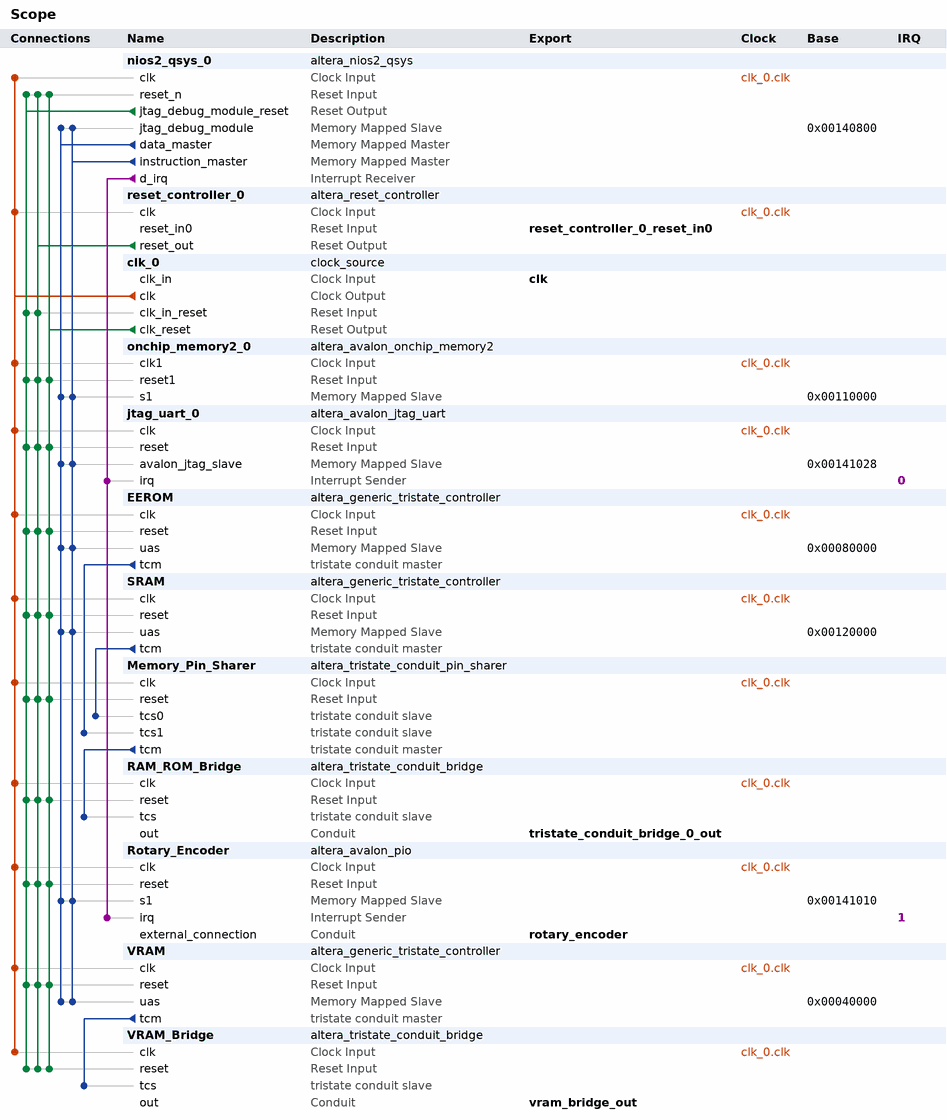
[diagram p0: system contents]
# Platform Designer (Qsys) system Scope, Cyclone III EP3C25Q240C8
# Parameters at their usual value, and those the tool derives, are not listed.
package require -exact qsys 13.1
create_system Scope
set_project_property DEVICE_FAMILY {Cyclone III}
set_project_property DEVICE EP3C25Q240C8

add_instance nios2_qsys_0 altera_nios2_qsys 13.1
set_instance_parameter_value nios2_qsys_0 resetSlave EEROM.uas
set_instance_parameter_value nios2_qsys_0 mmu_TLBMissExcSlave None
set_instance_parameter_value nios2_qsys_0 exceptionSlave EEROM.uas
set_instance_parameter_value nios2_qsys_0 breakSlave nios2_qsys_0.jtag_debug_module
set_instance_parameter_value nios2_qsys_0 impl Fast
set_instance_parameter_value nios2_qsys_0 icache_size 4096

add_instance reset_controller_0 altera_reset_controller 13.1
set_instance_parameter_value reset_controller_0 NUM_RESET_INPUTS 1
set_instance_parameter_value reset_controller_0 SYNC_DEPTH 2

add_instance clk_0 clock_source 13.1
set_instance_parameter_value clk_0 clockFrequency 30000000

add_instance onchip_memory2_0 altera_avalon_onchip_memory2 13.1
set_instance_parameter_value onchip_memory2_0 dataWidth 32
set_instance_parameter_value onchip_memory2_0 dualPort false
set_instance_parameter_value onchip_memory2_0 initMemContent true
set_instance_parameter_value onchip_memory2_0 initializationFileName onchip_mem.hex
set_instance_parameter_value onchip_memory2_0 memorySize 40960

add_instance jtag_uart_0 altera_avalon_jtag_uart 13.1
set_instance_parameter_value jtag_uart_0 simInteractiveOptions NO_INTERACTIVE_WINDOWS

add_instance EEROM altera_generic_tristate_controller 13.1
set_instance_parameter_value EEROM TCM_ADDRESS_W 19
set_instance_parameter_value EEROM TCM_DATA_W 8
set_instance_parameter_value EEROM TCM_BYTEENABLE_W 1
set_instance_parameter_value EEROM TCM_READ_WAIT 3
set_instance_parameter_value EEROM TCM_WRITE_WAIT 0
set_instance_parameter_value EEROM TCM_SETUP_WAIT 0
set_instance_parameter_value EEROM TCM_DATA_HOLD 0
set_instance_parameter_value EEROM TCM_MAX_PENDING_READ_TRANSACTIONS 1
set_instance_parameter_value EEROM TCM_TURNAROUND_TIME 2
set_instance_parameter_value EEROM TCM_TIMING_UNITS 1
set_instance_parameter_value EEROM TCM_READLATENCY 2
set_instance_parameter_value EEROM TCM_SYMBOLS_PER_WORD 1
set_instance_parameter_value EEROM USE_READ 1
set_instance_parameter_value EEROM USE_BEGINTRANSFER 0
set_instance_parameter_value EEROM USE_BYTEENABLE 0
set_instance_parameter_value EEROM USE_OUTPUTENABLE 1
set_instance_parameter_value EEROM ACTIVE_LOW_READ 0
set_instance_parameter_value EEROM ACTIVE_LOW_BYTEENABLE 0
set_instance_parameter_value EEROM ACTIVE_LOW_OUTPUTENABLE 1
set_instance_parameter_value EEROM ACTIVE_LOW_BEGINTRANSFER 0
set_instance_parameter_value EEROM CHIPSELECT_THROUGH_READLATENCY 0
set_instance_parameter_value EEROM MODULE_ASSIGNMENT_KEYS embeddedsw.configuration.hwClassnameDriverSupportList
set_instance_parameter_value EEROM MODULE_ASSIGNMENT_VALUES "altera_avalon_lan91c111\\,altera_avalon_cfi_flash"

add_instance SRAM altera_generic_tristate_controller 13.1
set_instance_parameter_value SRAM TCM_ADDRESS_W 17
set_instance_parameter_value SRAM TCM_DATA_W 8
set_instance_parameter_value SRAM TCM_BYTEENABLE_W 1
set_instance_parameter_value SRAM TCM_READ_WAIT 3
set_instance_parameter_value SRAM TCM_WRITE_WAIT 2
set_instance_parameter_value SRAM TCM_SETUP_WAIT 1
set_instance_parameter_value SRAM TCM_DATA_HOLD 1
set_instance_parameter_value SRAM TCM_MAX_PENDING_READ_TRANSACTIONS 1
set_instance_parameter_value SRAM TCM_TURNAROUND_TIME 2
set_instance_parameter_value SRAM TCM_TIMING_UNITS 1
set_instance_parameter_value SRAM TCM_READLATENCY 2
set_instance_parameter_value SRAM TCM_SYMBOLS_PER_WORD 1
set_instance_parameter_value SRAM USE_READ 1
set_instance_parameter_value SRAM USE_BEGINTRANSFER 0
set_instance_parameter_value SRAM USE_BYTEENABLE 0
set_instance_parameter_value SRAM USE_OUTPUTENABLE 1
set_instance_parameter_value SRAM ACTIVE_LOW_READ 0
set_instance_parameter_value SRAM ACTIVE_LOW_BYTEENABLE 0
set_instance_parameter_value SRAM ACTIVE_LOW_OUTPUTENABLE 1
set_instance_parameter_value SRAM ACTIVE_LOW_BEGINTRANSFER 0
set_instance_parameter_value SRAM CHIPSELECT_THROUGH_READLATENCY 0
set_instance_parameter_value SRAM MODULE_ASSIGNMENT_KEYS embeddedsw.configuration.hwClassnameDriverSupportList
set_instance_parameter_value SRAM MODULE_ASSIGNMENT_VALUES "altera_avalon_lan91c111\\,altera_avalon_cfi_flash"

add_instance Memory_Pin_Sharer altera_tristate_conduit_pin_sharer 13.1
set_instance_parameter_value Memory_Pin_Sharer NUM_INTERFACES 2
set_instance_parameter_value Memory_Pin_Sharer MODULE_ORIGIN_LIST EEROM.tcm,EEROM.tcm,EEROM.tcm,EEROM.tcm,EEROM.tcm,EEROM.tcm,SRAM.tcm,SRAM.tcm,SRAM.tcm,SRAM.tcm,SRAM.tcm,SRAM.tcm
set_instance_parameter_value Memory_Pin_Sharer SIGNAL_ORIGIN_LIST address,outputenable_n,write_n,read,data,chipselect_n,address,outputenable_n,write_n,read,data,chipselect_n
set_instance_parameter_value Memory_Pin_Sharer SHARED_SIGNAL_LIST address,,,,data,,address,,,,data

add_instance RAM_ROM_Bridge altera_tristate_conduit_bridge 13.1

add_instance Rotary_Encoder altera_avalon_pio 13.1
set_instance_parameter_value Rotary_Encoder bitClearingEdgeCapReg true
set_instance_parameter_value Rotary_Encoder captureEdge true
set_instance_parameter_value Rotary_Encoder direction Input
set_instance_parameter_value Rotary_Encoder generateIRQ true
set_instance_parameter_value Rotary_Encoder irqType EDGE
set_instance_parameter_value Rotary_Encoder width 6

add_instance VRAM altera_generic_tristate_controller 13.1
set_instance_parameter_value VRAM TCM_ADDRESS_W 18
set_instance_parameter_value VRAM TCM_DATA_W 8
set_instance_parameter_value VRAM TCM_BYTEENABLE_W 1
set_instance_parameter_value VRAM TCM_READ_WAIT 0
set_instance_parameter_value VRAM TCM_WRITE_WAIT 0
set_instance_parameter_value VRAM TCM_SETUP_WAIT 0
set_instance_parameter_value VRAM TCM_DATA_HOLD 1
set_instance_parameter_value VRAM TCM_MAX_PENDING_READ_TRANSACTIONS 1
set_instance_parameter_value VRAM TCM_TURNAROUND_TIME 2
set_instance_parameter_value VRAM TCM_TIMING_UNITS 1
set_instance_parameter_value VRAM TCM_READLATENCY 2
set_instance_parameter_value VRAM TCM_SYMBOLS_PER_WORD 1
set_instance_parameter_value VRAM USE_READ 1
set_instance_parameter_value VRAM USE_BEGINTRANSFER 0
set_instance_parameter_value VRAM USE_BYTEENABLE 0
set_instance_parameter_value VRAM USE_WAITREQUEST 1
set_instance_parameter_value VRAM USE_OUTPUTENABLE 0
set_instance_parameter_value VRAM ACTIVE_LOW_READ 0
set_instance_parameter_value VRAM ACTIVE_LOW_BYTEENABLE 0
set_instance_parameter_value VRAM ACTIVE_LOW_OUTPUTENABLE 0
set_instance_parameter_value VRAM ACTIVE_LOW_WAITREQUEST 1
set_instance_parameter_value VRAM ACTIVE_LOW_BEGINTRANSFER 0
set_instance_parameter_value VRAM CHIPSELECT_THROUGH_READLATENCY 0
set_instance_parameter_value VRAM MODULE_ASSIGNMENT_KEYS embeddedsw.configuration.hwClassnameDriverSupportList
set_instance_parameter_value VRAM MODULE_ASSIGNMENT_VALUES "altera_avalon_lan91c111\\,altera_avalon_cfi_flash"

add_instance VRAM_Bridge altera_tristate_conduit_bridge 13.1

# connections
add_connection clk_0.clk EEROM.clk clock
add_connection clk_0.clk jtag_uart_0.clk clock
add_connection clk_0.clk Memory_Pin_Sharer.clk clock
add_connection clk_0.clk nios2_qsys_0.clk clock
add_connection clk_0.clk onchip_memory2_0.clk1 clock
add_connection clk_0.clk RAM_ROM_Bridge.clk clock
add_connection clk_0.clk reset_controller_0.clk clock
add_connection clk_0.clk Rotary_Encoder.clk clock
add_connection clk_0.clk SRAM.clk clock
add_connection clk_0.clk VRAM.clk clock
add_connection clk_0.clk VRAM_Bridge.clk clock
add_connection clk_0.clk_reset EEROM.reset reset
add_connection clk_0.clk_reset jtag_uart_0.reset reset
add_connection clk_0.clk_reset Memory_Pin_Sharer.reset reset
add_connection clk_0.clk_reset nios2_qsys_0.reset_n reset
add_connection clk_0.clk_reset onchip_memory2_0.reset1 reset
add_connection clk_0.clk_reset RAM_ROM_Bridge.reset reset
add_connection clk_0.clk_reset Rotary_Encoder.reset reset
add_connection clk_0.clk_reset SRAM.reset reset
add_connection clk_0.clk_reset VRAM.reset reset
add_connection clk_0.clk_reset VRAM_Bridge.reset reset
add_connection nios2_qsys_0.jtag_debug_module_reset clk_0.clk_in_reset reset
add_connection nios2_qsys_0.jtag_debug_module_reset EEROM.reset reset
add_connection nios2_qsys_0.jtag_debug_module_reset jtag_uart_0.reset reset
add_connection nios2_qsys_0.jtag_debug_module_reset Memory_Pin_Sharer.reset reset
add_connection nios2_qsys_0.jtag_debug_module_reset nios2_qsys_0.reset_n reset
add_connection nios2_qsys_0.jtag_debug_module_reset onchip_memory2_0.reset1 reset
add_connection nios2_qsys_0.jtag_debug_module_reset RAM_ROM_Bridge.reset reset
add_connection nios2_qsys_0.jtag_debug_module_reset Rotary_Encoder.reset reset
add_connection nios2_qsys_0.jtag_debug_module_reset SRAM.reset reset
add_connection nios2_qsys_0.jtag_debug_module_reset VRAM.reset reset
add_connection nios2_qsys_0.jtag_debug_module_reset VRAM_Bridge.reset reset
add_connection reset_controller_0.reset_out clk_0.clk_in_reset reset
add_connection reset_controller_0.reset_out EEROM.reset reset
add_connection reset_controller_0.reset_out jtag_uart_0.reset reset
add_connection reset_controller_0.reset_out Memory_Pin_Sharer.reset reset
add_connection reset_controller_0.reset_out nios2_qsys_0.reset_n reset
add_connection reset_controller_0.reset_out onchip_memory2_0.reset1 reset
add_connection reset_controller_0.reset_out RAM_ROM_Bridge.reset reset
add_connection reset_controller_0.reset_out Rotary_Encoder.reset reset
add_connection reset_controller_0.reset_out SRAM.reset reset
add_connection reset_controller_0.reset_out VRAM.reset reset
add_connection reset_controller_0.reset_out VRAM_Bridge.reset reset
add_connection nios2_qsys_0.data_master EEROM.uas avalon
set_connection_parameter_value nios2_qsys_0.data_master/EEROM.uas baseAddress 0x00080000
add_connection nios2_qsys_0.data_master jtag_uart_0.avalon_jtag_slave avalon
set_connection_parameter_value nios2_qsys_0.data_master/jtag_uart_0.avalon_jtag_slave baseAddress 0x00141028
add_connection nios2_qsys_0.data_master nios2_qsys_0.jtag_debug_module avalon
set_connection_parameter_value nios2_qsys_0.data_master/nios2_qsys_0.jtag_debug_module baseAddress 0x00140800
add_connection nios2_qsys_0.data_master onchip_memory2_0.s1 avalon
set_connection_parameter_value nios2_qsys_0.data_master/onchip_memory2_0.s1 baseAddress 0x00110000
add_connection nios2_qsys_0.data_master Rotary_Encoder.s1 avalon
set_connection_parameter_value nios2_qsys_0.data_master/Rotary_Encoder.s1 baseAddress 0x00141010
add_connection nios2_qsys_0.data_master SRAM.uas avalon
set_connection_parameter_value nios2_qsys_0.data_master/SRAM.uas baseAddress 0x00120000
add_connection nios2_qsys_0.data_master VRAM.uas avalon
set_connection_parameter_value nios2_qsys_0.data_master/VRAM.uas baseAddress 0x00040000
add_connection nios2_qsys_0.instruction_master EEROM.uas avalon
set_connection_parameter_value nios2_qsys_0.instruction_master/EEROM.uas baseAddress 0x00080000
add_connection nios2_qsys_0.instruction_master jtag_uart_0.avalon_jtag_slave avalon
set_connection_parameter_value nios2_qsys_0.instruction_master/jtag_uart_0.avalon_jtag_slave baseAddress 0x00141028
add_connection nios2_qsys_0.instruction_master nios2_qsys_0.jtag_debug_module avalon
set_connection_parameter_value nios2_qsys_0.instruction_master/nios2_qsys_0.jtag_debug_module baseAddress 0x00140800
add_connection nios2_qsys_0.instruction_master onchip_memory2_0.s1 avalon
set_connection_parameter_value nios2_qsys_0.instruction_master/onchip_memory2_0.s1 baseAddress 0x00110000
add_connection nios2_qsys_0.instruction_master Rotary_Encoder.s1 avalon
set_connection_parameter_value nios2_qsys_0.instruction_master/Rotary_Encoder.s1 baseAddress 0x00141010
add_connection nios2_qsys_0.instruction_master SRAM.uas avalon
set_connection_parameter_value nios2_qsys_0.instruction_master/SRAM.uas baseAddress 0x00120000
add_connection nios2_qsys_0.instruction_master VRAM.uas avalon
set_connection_parameter_value nios2_qsys_0.instruction_master/VRAM.uas baseAddress 0x00040000
add_connection nios2_qsys_0.d_irq jtag_uart_0.irq interrupt
set_connection_parameter_value nios2_qsys_0.d_irq/jtag_uart_0.irq irqNumber 0
add_connection nios2_qsys_0.d_irq Rotary_Encoder.irq interrupt
set_connection_parameter_value nios2_qsys_0.d_irq/Rotary_Encoder.irq irqNumber 1
add_connection EEROM.tcm Memory_Pin_Sharer.tcs1 tristate_conduit
add_connection Memory_Pin_Sharer.tcm RAM_ROM_Bridge.tcs tristate_conduit
add_connection SRAM.tcm Memory_Pin_Sharer.tcs0 tristate_conduit
add_connection VRAM.tcm VRAM_Bridge.tcs tristate_conduit

# exported interfaces
add_interface clk clock sink
set_interface_property clk EXPORT_OF clk_0.clk_in
add_interface reset_controller_0_reset_in0 reset sink
set_interface_property reset_controller_0_reset_in0 EXPORT_OF reset_controller_0.reset_in0
add_interface tristate_conduit_bridge_0_out conduit end
set_interface_property tristate_conduit_bridge_0_out EXPORT_OF RAM_ROM_Bridge.out
add_interface rotary_encoder conduit end
set_interface_property rotary_encoder EXPORT_OF Rotary_Encoder.external_connection
add_interface vram_bridge_out conduit end
set_interface_property vram_bridge_out EXPORT_OF VRAM_Bridge.out

set_interconnect_requirement {$system} qsys_mm.clockCrossingAdapter HANDSHAKE
set_interconnect_requirement {$system} qsys_mm.maxAdditionalLatency 1
set_interconnect_requirement {$system} qsys_mm.insertDefaultSlave false

save_system Scope.qsys
